# EAGLE design teaspoon (EAGLE 6.5.0)
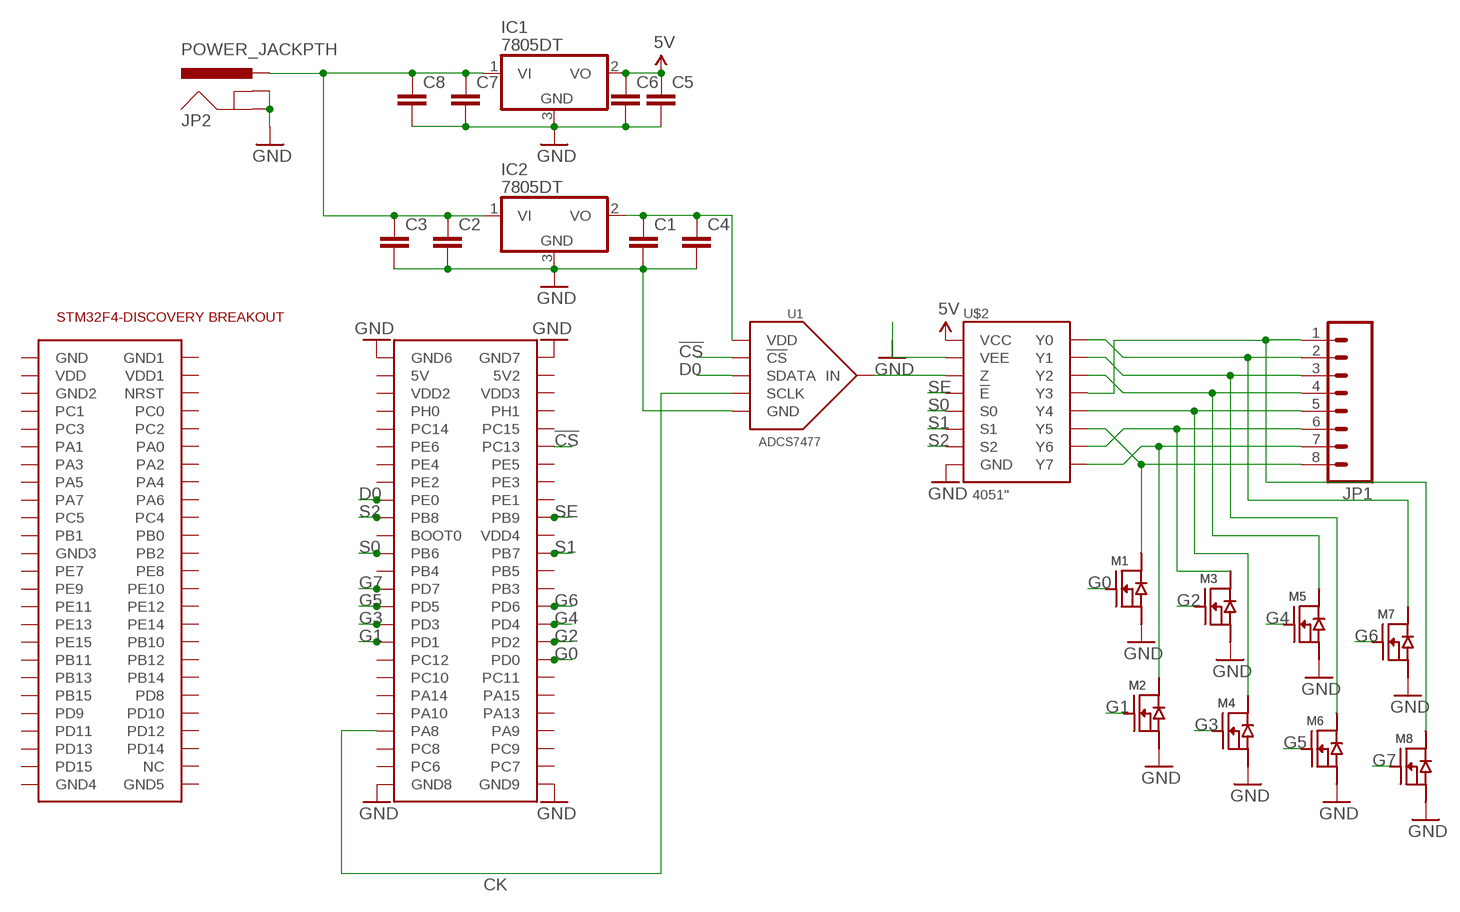
[diagram p0: schematic, sheet 1]

## Parts
C1  C-EUC0805  [C0805]
C2  C-EUC0805  [C0805]
C3  C-EUC0805  [C0805]
C4  C-EUC0805  [C0805]
C5  C-EUC0805  [C0805]
C6  C-EUC0805  [C0805]
C7  C-EUC0805  [C0805]
C8  C-EUC0805  [C0805]
IC1  7805DT  [TO252]
IC2  7805DT  [TO252]
JP1  M08LONGPADS  [1X08_LONGPADS]
JP2  POWER_JACKPTH  [POWER_JACK_PTH]
M1  N-FET  [SOT23-3]
M2  N-FET  [SOT23-3]
M3  N-FET  [SOT23-3]
M4  N-FET  [SOT23-3]
M5  N-FET  [SOT23-3]
M6  N-FET  [SOT23-3]
M7  N-FET  [SOT23-3]
M8  N-FET  [SOT23-3]
U1  ADCS7477  [SOT-23-6]
U$1  STM32F4-DISCOVERY  [STM32F4-DISCOVERY]
U$2  4051"  [TSSOP-16]

## Nets
5V: C5.1 C6.1 IC1.2(VO) U$2.P$16(VCC)
!CS: U1.P$6(!CS) U$1.P$62(PC13)
CK: U1.P$4(SCLK) U$1.P$93(PA8)
D0: U1.P$5(SDATA) U$1.P$67(PE0)
G0: M1.1(G) U$1.P$86(PD0)
G1: M2.1(G) U$1.P$83(PD1)
G2: M3.1(G) U$1.P$84(PD2)
G3: M4.1(G) U$1.P$81(PD3)
G4: M5.1(G) U$1.P$82(PD4)
G5: M6.1(G) U$1.P$79(PD5)
G6: M7.1(G) U$1.P$80(PD6)
G7: M8.1(G) U$1.P$77(PD7)
GND: C1.2 C2.2 C3.2 C4.2 C5.2 C6.2 C7.2 C8.2 IC1.3(GND) IC2.3(GND) JP2.GND JP2.GNDBREAK M1.2(S) M2.2(S) M3.2(S) M4.2(S) M5.2(S) M6.2(S) M7.2(S) M8.2(S) U1.P$2(GND) U$1.P$51(GND6) U$1.P$52(GND7) U$1.P$99(GND8) U$1.P$100(GND9) U$2.P$7(VEE) U$2.P$8(GND)
N$1: U1.P$3(IN) U$2.P$3(Z)
N$2: C1.1 C4.1 IC2.2(VO) U1.P$1(VDD)
N$5: C2.1 C3.1 C7.1 C8.1 IC1.1(VI) IC2.1(VI) JP2.PWR
N$8: JP1.1 M8.3(D) U$2.P$12(Y3)
N$9: JP1.2 M7.3(D) U$2.P$13(Y0)
N$10: JP1.3 M6.3(D) U$2.P$14(Y1)
N$11: JP1.4 M5.3(D) U$2.P$15(Y2)
N$12: JP1.5 M4.3(D) U$2.P$1(Y4)
N$13: JP1.6 M3.3(D) U$2.P$2(Y6)
N$14: JP1.7 M2.3(D) U$2.P$4(Y7)
N$15: JP1.8 M1.3(D) U$2.P$5(Y5)
S0: U$1.P$73(PB6) U$2.P$11(S0)
S1: U$1.P$74(PB7) U$2.P$10(S1)
S2: U$1.P$69(PB8) U$2.P$9(S2)
SE: U$1.P$70(PB9) U$2.P$6(!E)
Unconnected: U$1.P$1(GND) U$1.P$2(GND1) U$1.P$3(VDD) U$1.P$4(VDD1) U$1.P$5(GND2) U$1.P$6(NRST) U$1.P$7(PC1) U$1.P$8(PC0) U$1.P$9(PC3) U$1.P$10(PC2) U$1.P$11(PA1) U$1.P$12(PA0) U$1.P$13(PA3) U$1.P$14(PA2) U$1.P$15(PA5) U$1.P$16(PA4) U$1.P$17(PA7) U$1.P$18(PA6) U$1.P$19(PC5) U$1.P$20(PC4) U$1.P$21(PB1) U$1.P$22(PB0) U$1.P$23(GND3) U$1.P$24(PB2) U$1.P$25(PE7) U$1.P$26(PE8) U$1.P$27(PE9) U$1.P$28(PE10) U$1.P$29(PE11) U$1.P$30(PE12) U$1.P$31(PE13) U$1.P$32(PE14) U$1.P$33(PE15) U$1.P$34(PB10) U$1.P$35(PB11) U$1.P$36(PB12) U$1.P$37(PB13) U$1.P$38(PB14) U$1.P$39(PB15) U$1.P$40(PD8) U$1.P$41(PD9) U$1.P$42(PD10) U$1.P$43(PD11) U$1.P$44(PD12) U$1.P$45(PD13) U$1.P$46(PD14) U$1.P$47(PD15) U$1.P$48(NC) U$1.P$49(GND4) U$1.P$50(GND5) U$1.P$53(5V) U$1.P$54(5V2) U$1.P$55(VDD2) U$1.P$56(VDD3) U$1.P$57(PH0) U$1.P$58(PH1) U$1.P$59(PC14) U$1.P$60(PC15) U$1.P$61(PE6) U$1.P$63(PE4) U$1.P$64(PE5) U$1.P$65(PE2) U$1.P$66(PE3) U$1.P$68(PE1) U$1.P$71(BOOT0) U$1.P$72(VDD4) U$1.P$75(PB4) U$1.P$76(PB5) U$1.P$78(PB3) U$1.P$85(PC12) U$1.P$87(PC10) U$1.P$88(PC11) U$1.P$89(PA14) U$1.P$90(PA15) U$1.P$91(PA10) U$1.P$92(PA13) U$1.P$94(PA9) U$1.P$95(PC8) U$1.P$96(PC9) U$1.P$97(PC6) U$1.P$98(PC7)

## Library data of the parts
C1-C8 = rcl:C-EU: CAPACITOR, European symbol
IC1 IC2 = linear:78*: Positive VOLTAGE REGULATOR Source: http://cache.national.com/ds/LM/LM78L05.pdf http://www.fairchildsemi.com/ds/LM/LM7805.pdf
JP1 = SparkFun-Connectors:M08: Header 8 Standard 8-pin 0.1" header. Use with straight break away headers (SKU : PRT-00116), right angle break away headers (PRT-00553), swiss pins (PRT-00743), machine pins (PRT-00117), and female headers (PRT-00115).
JP2 = SparkFun-Connectors:POWER_JACK: Power Jack This is the standard 5.5mm barrel jack for power. The PTH is the most common, proven, reliable, footprint. The Slot footprint only works if the mill layer is transmitted to the PCB fab house so be warned. Mating wall wart : TOL-00298 (and others); PROD_ID: CONN-08197
M1-M8 = butter:N-FET
U1 = butter:ADCS7477: TI ADCS7477 10 bit 1MSPS ADC 5V 10mW Digikey <http://www.digikey.com/product-detail/en/ADCS7477AIMF%2FNOPB/ADCS7477AIMF%2FNOPBTR-ND/568478>
U$1 = STM32F4-DISCOVERY:STM32F4-DISCOVERY
U$2 = butter:4051: 74HC4051PW NXP 8:1 Analog Multiplexer digikey <http://www.digikey.com/product-detail/en/74HC4051PW,118/568-2259-1-ND/946721>

## Board
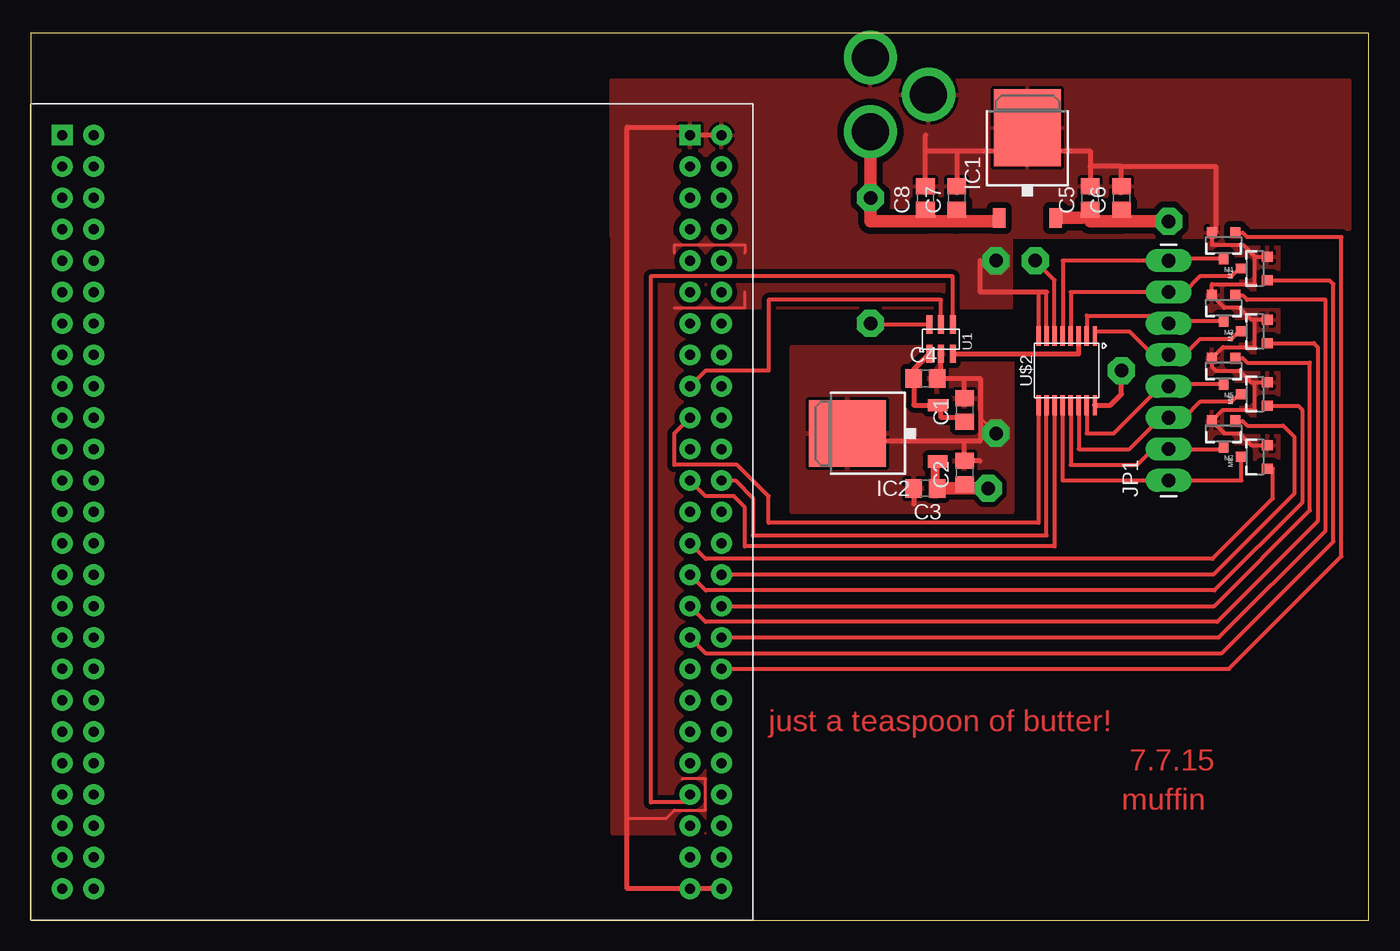
[diagram p1: board, top side]
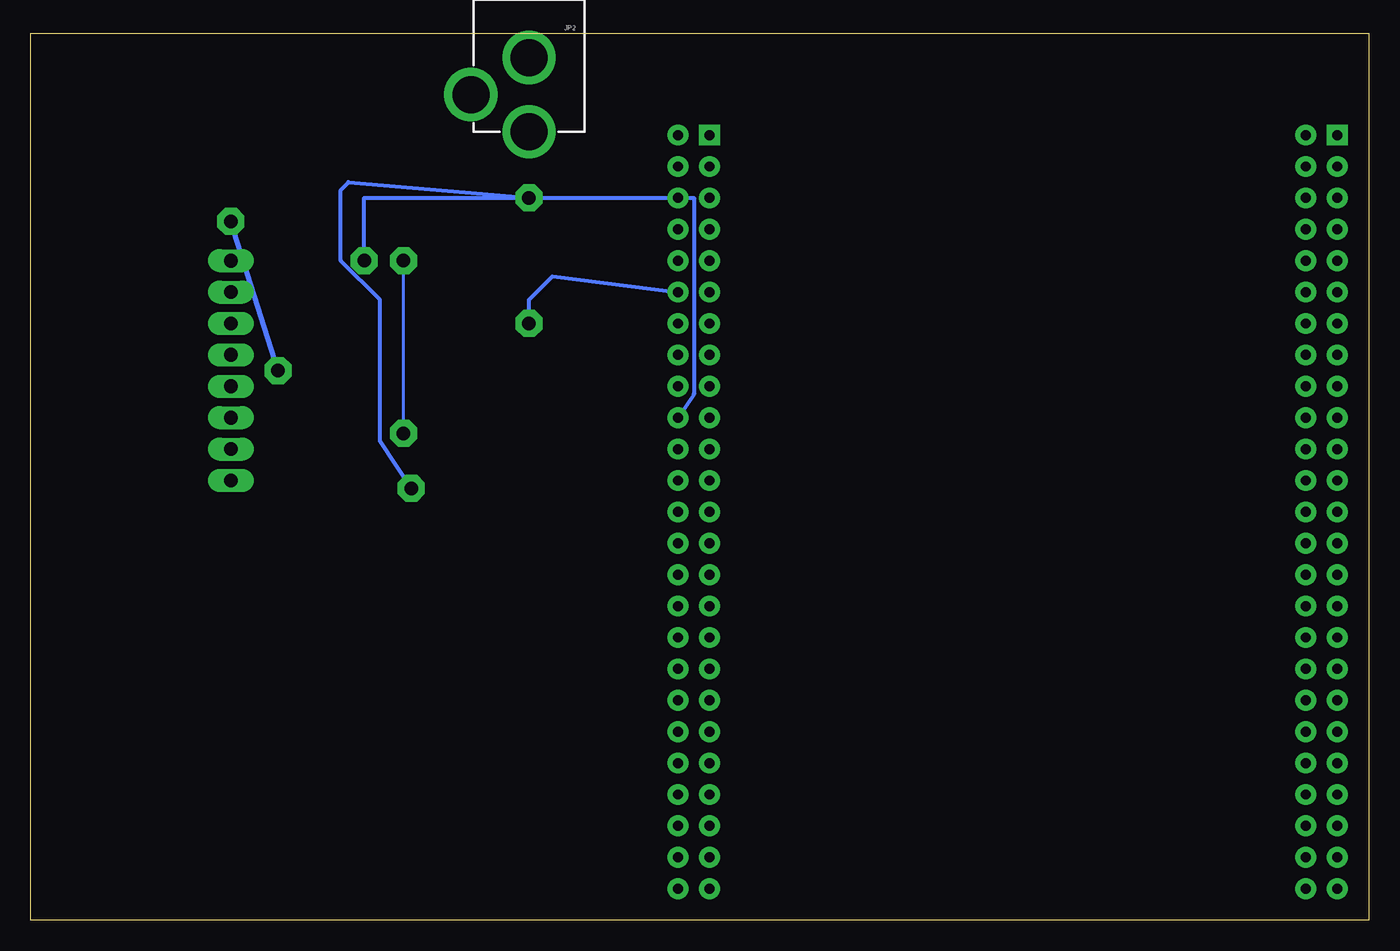
[diagram p2: board, bottom side, seen from below]

Size 108.25 x 71.75 mm. Coordinates in mm from the lower left corner, seen from the top.
Outline: 0,0 108.25,0 108.25,71.75 0,71.75 0,0
Copper layers (1*16): Top 0.035mm / dielectric 1.5mm / Bottom 0.035mm
Design rules "default": minimum track width 10mil, minimum drill 24mil, track to track 8mil, track to pad 8mil, pad to pad 8mil, via to via 8mil, smd to smd 8mil, copper to edge 40mil, drill to drill 8mil, minimum pad ring 10mil, minimum via ring 8mil, stop-mask expansion 4mil, vias tented up to drill 0mil, thermal gap 10mil

### Footprints (pad centres in the part's own frame; a part is rotated, then mirrored left to right if it is on the bottom)
C0805 = smd 1.3 x 1.5: 1 -0.95,0; 2 0.95,0
TO252 = smd 1 x 1.6: 1 -2.28,-4.8; 2 2.28,-4.8 | smd 5.4 x 6.2: 3 0,2.5
1X08_LONGPADS = drill 1.118 pad 1.88 long: 1 0,0; 2 2.54,0; 3 5.08,0; 4 7.62,0; 5 10.16,0; 6 12.7,0; 7 15.24,0; 8 17.78,0
POWER_JACK_PTH = drill 2.997 pad 4.318: GND 0,7.7; GNDBREAK 4.7,10.7; PWR 0,13.7
SOT23-3 = smd 0.8 x 0.9: 1 -0.95,-1; 2 0.95,-1; 3 0,1.1
SOT-23-6 = smd 1.473 x 0.483: P$1 -1.181,0.95; P$2 -1.181,0; P$3 -1.181,-0.95; P$4 1.181,-0.95; P$5 1.181,0; P$6 1.181,0.95
STM32F4-DISCOVERY = drill 0.8 pad 1.676 square: P$1 -27.94,30.48; P$51 22.86,30.48 | drill 0.8 pad 1.676: P$2 -25.4,30.48; P$3 -27.94,27.94; P$4 -25.4,27.94; P$5 -27.94,25.4; P$6 -25.4,25.4; P$7 -27.94,22.86; P$8 -25.4,22.86; P$9 -27.94,20.32; P$10 -25.4,20.32; P$11 -27.94,17.78; P$12 -25.4,17.78; P$13 -27.94,15.24; P$14 -25.4,15.24; P$15 -27.94,12.7; P$16 -25.4,12.7; P$17 -27.94,10.16; P$18 -25.4,10.16; P$19 -27.94,7.62; P$20 -25.4,7.62; P$21 -27.94,5.08; P$22 -25.4,5.08; P$23 -27.94,2.54; P$24 -25.4,2.54; P$25 -27.94,0; P$26 -25.4,0; P$27 -27.94,-2.54; P$28 -25.4,-2.54; P$29 -27.94,-5.08; P$30 -25.4,-5.08; P$31 -27.94,-7.62; P$32 -25.4,-7.62; P$33 -27.94,-10.16; P$34 -25.4,-10.16; P$35 -27.94,-12.7; P$36 -25.4,-12.7; P$37 -27.94,-15.24; P$38 -25.4,-15.24; P$39 -27.94,-17.78; P$40 -25.4,-17.78; P$41 -27.94,-20.32; P$42 -25.4,-20.32; P$43 -27.94,-22.86; P$44 -25.4,-22.86; P$45 -27.94,-25.4; P$46 -25.4,-25.4; P$47 -27.94,-27.94; P$48 -25.4,-27.94; P$49 -27.94,-30.48; P$50 -25.4,-30.48; P$52 25.4,30.48; P$53 22.86,27.94; P$54 25.4,27.94; P$55 22.86,25.4; P$56 25.4,25.4; P$57 22.86,22.86; P$58 25.4,22.86; P$59 22.86,20.32; P$60 25.4,20.32; P$61 22.86,17.78; P$62 25.4,17.78; P$63 22.86,15.24; P$64 25.4,15.24; P$65 22.86,12.7; P$66 25.4,12.7; P$67 22.86,10.16; P$68 25.4,10.16; P$69 22.86,7.62; P$70 25.4,7.62; P$71 22.86,5.08; P$72 25.4,5.08; P$73 22.86,2.54; P$74 25.4,2.54; P$75 22.86,0; P$76 25.4,0; P$77 22.86,-2.54; P$78 25.4,-2.54; P$79 22.86,-5.08; P$80 25.4,-5.08; P$81 22.86,-7.62; P$82 25.4,-7.62; P$83 22.86,-10.16; P$84 25.4,-10.16; P$85 22.86,-12.7; P$86 25.4,-12.7; P$87 22.86,-15.24; P$88 25.4,-15.24; P$89 22.86,-17.78; P$90 25.4,-17.78; P$91 22.86,-20.32; P$92 25.4,-20.32; P$93 22.86,-22.86; P$94 25.4,-22.86; P$95 22.86,-25.4; P$96 25.4,-25.4; P$97 22.86,-27.94; P$98 25.4,-27.94; P$99 22.86,-30.48; P$100 25.4,-30.48
TSSOP-16 = smd 1.6 x 0.35: P$1 -2.8,2.275; P$2 -2.8,1.625; P$3 -2.8,0.975; P$4 -2.8,0.325; P$5 -2.8,-0.325; P$6 -2.8,-0.975; P$7 -2.8,-1.625; P$8 -2.8,-2.275; P$9 2.8,-2.275; P$10 2.8,-1.625; P$11 2.8,-0.975; P$12 2.8,-0.325; P$13 2.8,0.325; P$14 2.8,0.975; P$15 2.8,1.625; P$16 2.8,2.275

### Placement (x,y rotation side)
C1  75.56,41.27 90 top
C2  75.56,36.2 90 top
C3  72.39,34.92 180 top
C4  72.39,43.81 0 top
C5  85.72,58.42 90 top
C6  88.27,58.42 90 top
C7  74.93,58.42 90 top
C8  72.39,58.42 90 top
IC1  80.64,61.59 0 top
IC2  68.58,39.37 90 top
JP1  92.08,35.56 90 top
JP2  67.94,77.47 180 bottom
M1  96.52,54.61 180 top
M2  99.06,52.7 90 top
M3  96.52,49.53 180 top
M4  99.06,47.62 90 top
M5  96.52,44.45 180 top
M6  99.06,42.55 90 top
M7  96.52,39.37 180 top
M8  99.06,37.47 90 top
U1  73.66,46.99 90 top
U$1  30.48,33.02 0 top
U$2  83.82,44.45 270 top

### Tracks (layer width: path | path; a pad name or v marks a point on that pad's centre or on a via)
5V  (via drill 1.1 pad 2.18)
  Top 0.406: 85.05,56.8 C5.1 85.72,56.52 | 88.27,56.52 C6.1 | U$2.P$16 87.37,41.65 88.27,42.55 v88.27,44.45
  Top 1.016: IC1.2 85.05,56.8 | 85.72,56.52 88.27,56.52 v92.08,56.52
  Bottom 0.406: v88.27,44.45 v92.08,56.52
!CS  (via drill 1.1 pad 2.18)
  Top 0.305: U1.P$6 68.03,48.17 v67.94,48.26
  Bottom 0.305: v67.94,48.26 67.94,50.16 66.04,52.07 U$1.P$62
CK
  Top 0.305: 53.34,9.53 50.16,9.53 50.16,52.07 74.61,52.07 U1.P$4
  Top 0.406: U$1.P$93 53.34,9.53
D0
  Top 0.305: U1.P$5 73.66,50.16 59.69,50.16 59.69,44.45 54.61,44.45 U$1.P$67
G0
  Top 0.305: M1.1 98.06,55.61 98.42,55.24 106.05,55.24 106.05,29.41 96.95,20.32 U$1.P$86
G1
  Top 0.305: M2.1 105.09,51.76 105.41,51.44 105.41,30.61 96.39,21.59 54.61,21.59 U$1.P$83
G2
  Top 0.305: M3.1 98.06,50.53 98.42,50.16 104.78,50.16 104.78,31.5 96.14,22.86 U$1.P$84
G3
  Top 0.305: M4.1 103.82,46.67 104.14,46.35 104.14,32.26 96.01,24.13 54.61,24.13 U$1.P$81
G4
  Top 0.305: M5.1 98.06,45.45 98.42,45.09 103.5,45.09 103.5,33.15 95.75,25.4 U$1.P$82
G5
  Top 0.305: M6.1 102.55,41.59 102.87,41.27 102.87,33.77 95.77,26.67 54.61,26.67 U$1.P$79
G6
  Top 0.305: M7.1 98.06,40.37 98.42,40.01 101.34,40.01 102.23,39.11 102.23,34.48 95.7,27.94 U$1.P$80
G7
  Top 0.305: U$1.P$77 54.61,29.21 95.61,29.21 100.51,34.11 100.51,36.52 M8.1
GND  (via drill 1.1 pad 2.18)
  Top 0.254: 52.7,11.43 54.61,11.43 54.61,8.89 52.07,8.89 51.44,8.26 48.26,8.26 | 52.07,49.53 57.78,49.53 57.78,50.8 | 52.07,53.98 52.07,54.61 57.78,54.61 57.78,53.98 | 76.83,43.81 76.83,40.64 v78.11,39.37 | v78.11,53.34 76.83,53.34
  Top 0.305: 99.06,53.66 99.06,51.44 95.57,51.44 M3.2 96.57,49.53 97.79,49.53 98.75,48.58 99.06,48.58 | 99.06,53.66 M2.2 | M1.2 95.57,54.61 98.11,54.61 99.06,53.66 | M4.2 99.06,48.58 | 99.06,43.49 98.75,43.49 97.79,44.45 95.89,44.45 95.57,44.77 M5.2 96.47,46.35 99.06,46.35 99.06,48.58 | 99.06,43.49 M6.2 | M8.2 98.75,38.41 97.79,39.37 96.57,39.37 M7.2 96.47,41.27 99.06,41.27 99.06,43.49 | U$2.P$7 82.19,50.8 81.55,50.8 U$2.P$8
  Top 0.406: 88.27,60.96 85.72,60.96 | 85.72,60.96 C5.2 | IC1.3 80.64,62.23 | 80.64,62.23 85.72,62.23 85.72,60.96 | C8.2 72.39,62.23 | 72.39,62.23 74.93,62.23 | 74.93,62.23 C7.2 | 74.93,62.23 80.64,62.23 | 72.39,62.23 72.39,63.5 | U$1.P$52 U$1.P$51 53.98,63.5 | C6.2 88.27,60.96 | 88.27,60.96 95.89,60.96 95.89,55.61 M1.2 | U$1.P$100 U$1.P$99 48.26,2.54 48.26,8.26 48.26,64.14 53.98,64.14 53.98,63.5 | 53.98,62.87 53.98,63.5 | 82.19,50.8 76.83,50.8 76.83,53.34 | U1.P$2 73.66,43.81 C4.2 75.56,43.81 | 75.56,43.81 76.83,43.81 76.83,38.73 75.56,38.73 | 75.56,38.73 66.04,38.73 66.04,39.37 IC2.3 | C1.2 75.56,43.81 | 75.56,38.73 C2.2 76.83,37.15 | C3.2 71.44,33.66
  Bottom 0.254: v78.11,39.37 v78.11,53.34
  pour Top (isolate 0.406): 46.99,6.99 54.61,6.99 54.61,12.7 53.34,12.7 53.34,49.53 79.38,49.53 79.38,55.24 46.99,55.24
  pour Top (isolate 0.406): 61.59,46.35 79.38,46.35 79.38,33.02 61.59,33.02
  pour Top (isolate 0.508): 46.99,55.24 46.99,67.94 106.68,67.94 106.68,55.88 100.97,55.88 100.97,35.56 95.25,35.56 95.25,55.24
N$1
  Top 0.406: U1.P$3 84.8,45.81 U$2.P$3
N$2
  Top 0.406: U1.P$1 71.44,44.54 C4.1 71.44,41.65 IC2.2 73.66,41.65 73.66,40.64 75.56,40.64 C1.1
N$5  (via drill 1.1 pad 2.18)
  Top 0.305: IC2.1 73.38,35.2 73.66,34.92 73.66,34.29
  Top 0.406: IC1.1 78.36,56.52 | C7.1 74.93,56.52 | 72.39,56.52 C8.1 | IC2.1 73.03,37.09 73.03,34.29 73.34,34.29 C3.1 73.66,34.92 75.56,34.92 C2.1
  Top 1.016: 78.36,56.52 74.93,56.52 72.39,56.52 67.94,56.52 v67.94,58.42 JP2.PWR | 73.66,34.92 v77.47,34.92
  Bottom 0.305: v77.47,34.92 80.01,38.73 80.01,50.16 83.19,53.34 83.19,59.05 82.55,59.69 v67.94,58.42
N$8
  Top 0.305: U$2.P$12 83.5,35.56 JP1.1 97.96,35.56 M8.3
N$9
  Top 0.305: M7.3 96.52,38.1 JP1.2 90.81,38.1 89.53,36.83 84.14,36.83 U$2.P$13
N$10
  Top 0.305: M6.3 97.79,42.55 97.16,41.91 94.61,41.91 93.34,40.64 JP1.3 91.44,40.64 88.9,38.1 84.8,38.1 U$2.P$14
N$11
  Top 0.305: M5.3 92.08,43.35 JP1.4 91.44,43.18 87.63,39.37 85.44,39.37 U$2.P$15
N$12
  Top 0.305: M4.3 97.79,47.62 97.16,46.99 94.61,46.99 93.34,45.72 JP1.5 90.81,45.72 88.9,47.62 86.09,47.62 U$2.P$1
N$13
  Top 0.305: U$2.P$2 85.44,48.9 92.08,48.9 JP1.6 92.25,48.43 M3.3
N$14
  Top 0.305: U$2.P$4 84.14,50.8 JP1.7 93.34,50.8 94.61,52.07 97.16,52.07 97.79,52.7 M2.3
N$15
  Top 0.305: U$2.P$5 83.5,53.34 JP1.8 92.25,53.51 M1.3
S0
  Top 0.305: U$1.P$73 54.61,34.29 56.89,34.29 57.78,33.39 57.78,30.23 82.84,30.23 U$2.P$11
S1
  Top 0.305: U$1.P$74 57,35.56 58.42,34.14 58.42,31.11 82.19,31.11 U$2.P$10
S2
  Top 0.305: U$2.P$9 81.55,32.13 59.69,32.13 59.69,34.29 57.15,36.83 52.07,36.83 52.07,39.37 U$1.P$69
SE  (via drill 1.1 pad 2.18)
  Top 0.305: U$2.P$6 82.84,51.77 v81.28,53.34
  Bottom 0.305: v81.28,53.34 81.28,58.42 54.61,58.42 54.61,42.55 U$1.P$70

### Text on the board
Top: just a teaspoon of butter! | 7.7.15 | muffin